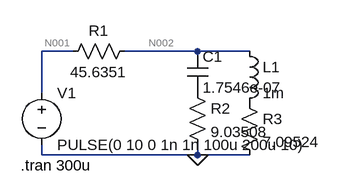
[diagram p0: schematic transitorio_22.asc]
transitorio_22.asc, the LTspice schematic file:
Version 4.1
SHEET 1 880 680
WIRE 64 64 16 64
WIRE 256 64 144 64
WIRE 336 64 256 64
WIRE 16 128 16 64
WIRE 16 224 16 208
WIRE 256 224 256 208
WIRE 256 224 16 224
WIRE 336 224 256 224
FLAG 256 224 0
SYMBOL voltage 16 112 R0
WINDOW 123 0 0 Left 0
WINDOW 39 0 0 Left 0
SYMATTR InstName V1
SYMATTR Value PULSE(0 10 0 1n 1n 100u 200u 10)
SYMBOL res 160 48 R90
WINDOW 0 0 56 VBottom 2
WINDOW 3 32 56 VTop 2
SYMATTR InstName R1
SYMATTR Value 45.6351
SYMBOL cap 240 64 R0
SYMATTR InstName C1
SYMATTR Value 1.7546e-07
SYMBOL res 240 112 R0
SYMATTR InstName R2
SYMATTR Value 9.03508
SYMBOL ind 320 48 R0
SYMATTR InstName L1
SYMATTR Value 1m
SYMATTR SpiceLine Rser=14
SYMBOL res 320 128 R0
SYMATTR InstName R3
SYMATTR Value 7.09524
TEXT -16 240 Left 2 !.tran 300u

The netlist it stands for:
* transitorio_22.asc
V1 N001 0 PULSE(0 10 0 1n 1n 100u 200u 10)
R1 N002 N001 45.6351
C1 N002 P001 1.7546e-07
R2 P001 0 9.03508
L1 N002 P002 1m Rser=14
R3 P002 0 7.09524
.tran 300u
.backanno
.end

* Results of the author's LTspice run, read from the files saved beside the schematic
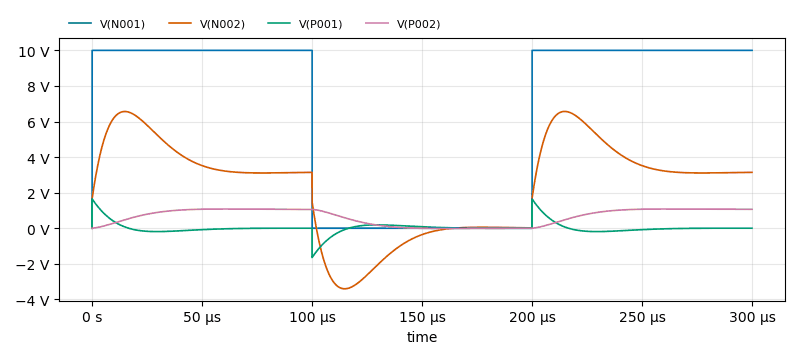
[diagram p1: Transient Analysis of transitorio_22.asc, plotted from the saved traces]
* Transient Analysis, 1 run:
*   V(N001): min 0 V, max 10 V, average 6.667 V, rms 8.165 V, last 10 V
*   V(N002): min -3.405 V, max 6.566 V, average 2.423 V, rms 3.617 V, last 3.142 V
*   V(P001): min -1.65 V, max 1.653 V, average 16.59 mV, rms 330.3 mV, last 2.528 mV
*   V(P002): min -17.13 mV, max 1.08 V, average 646.8 mV, rms 789.4 mV, last 1.064 V